# EAGLE design gatorBytes_button_board (EAGLE 9.1.0)
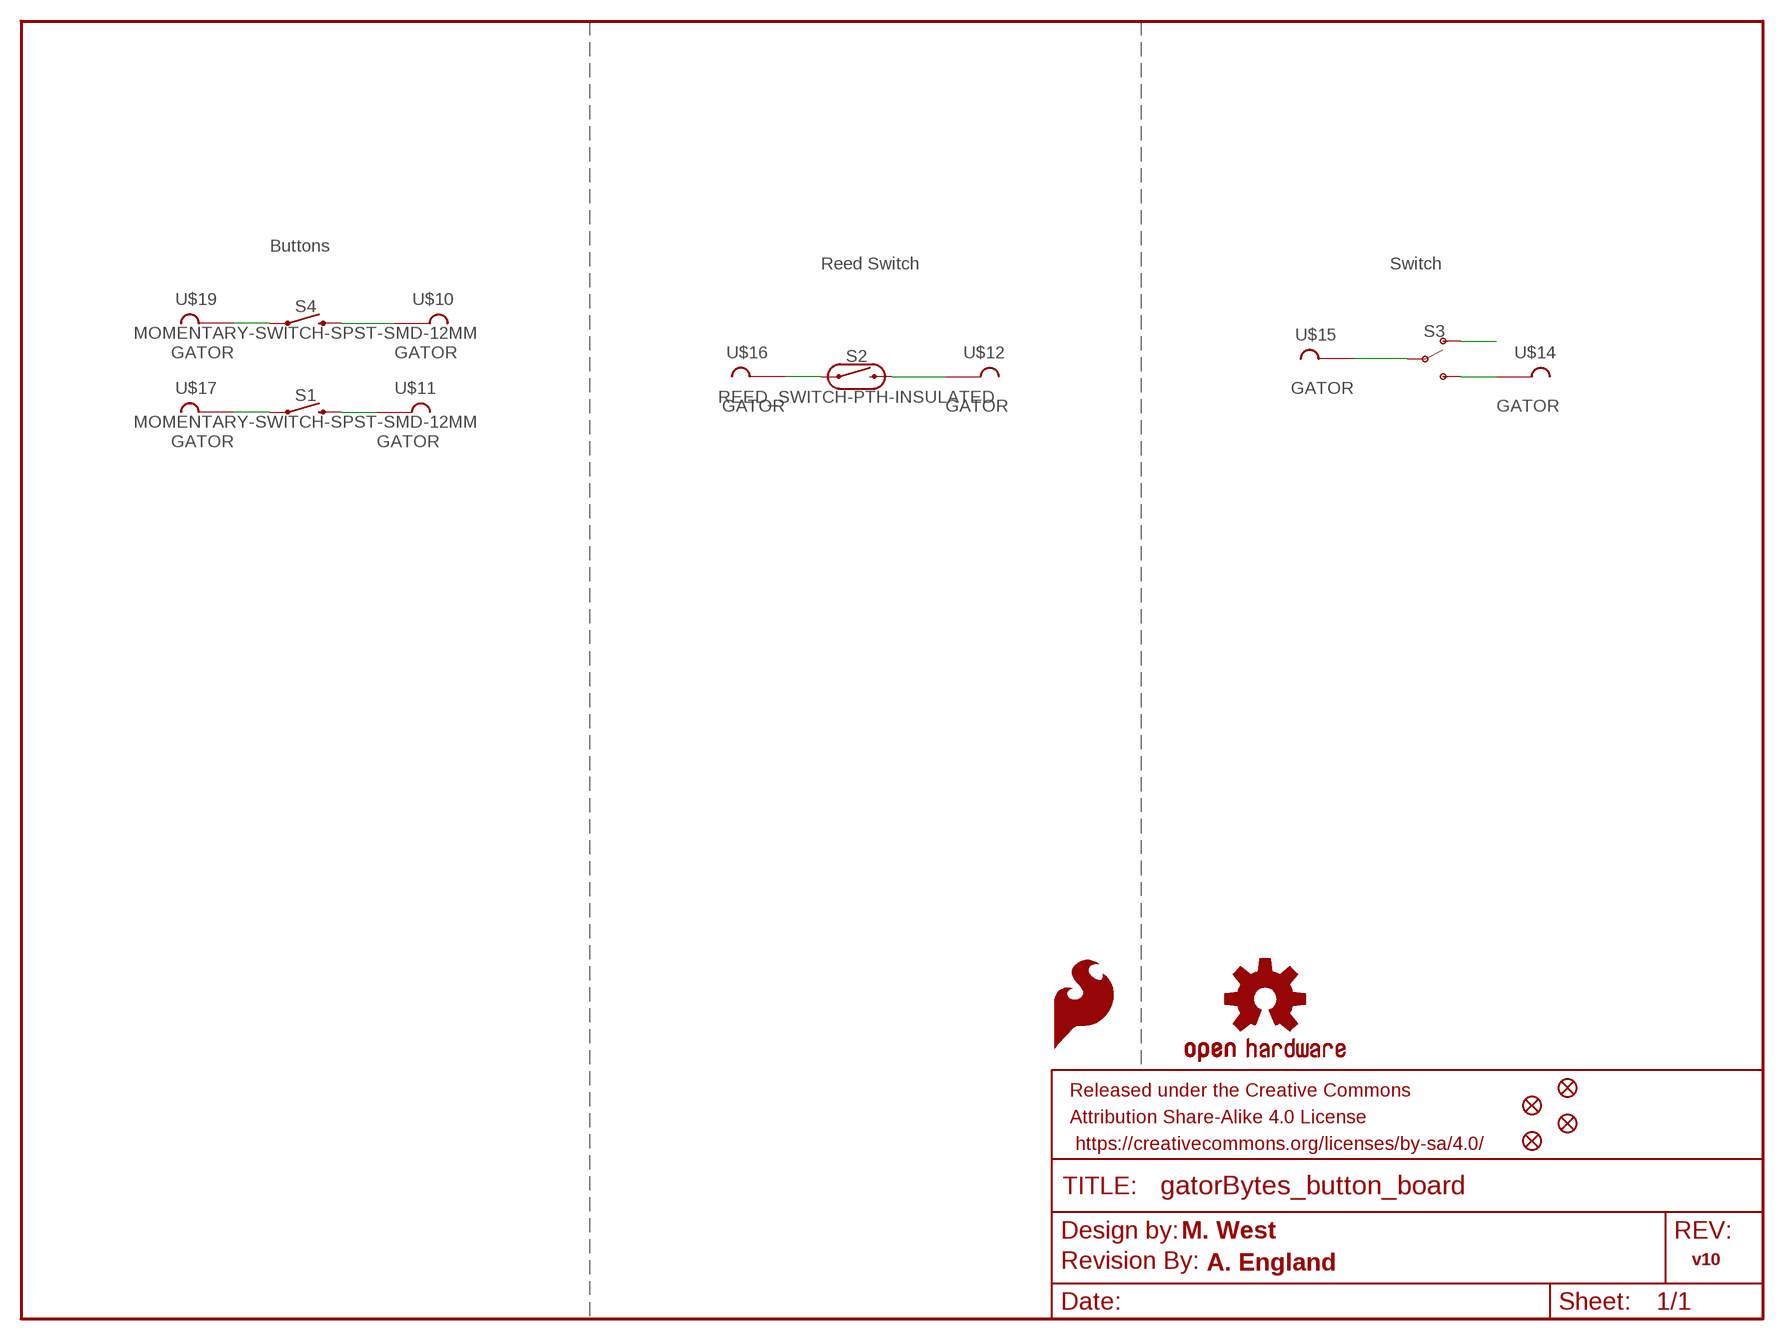
[diagram p0: schematic, sheet 1]

## Parts
FD1  FIDUCIALUFIDUCIAL  [FIDUCIAL-MICRO]
FD2  FIDUCIALUFIDUCIAL  [FIDUCIAL-MICRO]
FD3  FIDUCIALUFIDUCIAL  [FIDUCIAL-MICRO]
FD4  FIDUCIALUFIDUCIAL  [FIDUCIAL-MICRO]
FRAME1  FRAME-LETTER  [CREATIVE_COMMONS]
LOGO1  SFE_LOGO_FLAME.1_INCH  [SFE_LOGO_FLAME_.1]
LOGO2  OSHW-LOGOS  [OSHW-LOGO-S]
LOGO9  REVISION  [REVISION]
S1  MOMENTARY-SWITCH-SPST-SMD-12MM  [TACTILE_SWITCH_SMD_12MM]
S2  REED_SWITCH-PTH-INSULATED  [REED_SWITCH_PLASTIC]
S3  SWITCH-SPDT-SMD-AYZ0202  [SWITCH_DPDT_SMD_AYZ0202]
S4  MOMENTARY-SWITCH-SPST-SMD-12MM  [TACTILE_SWITCH_SMD_12MM]
U$10  GATOR  [GATOR]
U$11  GATOR  [GATOR]
U$12  GATOR  [GATOR]
U$14  GATOR  [GATOR]
U$15  GATOR  [GATOR]
U$16  GATOR  [GATOR]
U$17  GATOR  [GATOR]
U$19  GATOR  [GATOR]

## Nets
N$1: S4.1 U$19.P$1 U$19.P$2
N$2: S4.3 U$10.P$1 U$10.P$2
N$3: S1.1 U$17.P$1 U$17.P$2
N$4: S1.3 U$11.P$1 U$11.P$2
N$5: S2.P$1 U$16.P$1 U$16.P$2
N$6: S2.P$2 U$12.P$1 U$12.P$2
N$7: S3.2(P) U$15.P$1 U$15.P$2
N$8: S3.1(O)
N$9: S3.3(S) U$14.P$1 U$14.P$2

## Notes on the sheet
- Buttons
- Reed Switch | Switch
- M. West
- v10
- A. England

## Library data of the parts
FD1-FD4 = SparkFun-Aesthetics:FIDUCIAL: Fiducial Alignment Points Point-of-reference for pick-and-place machines and other optical instruments.
FRAME1 = SparkFun-Aesthetics:FRAME-LETTER: Schematic Frame - Letter Standard 8.5x11 US Letter frame
LOGO1 = SparkFun-Aesthetics:SFE_LOGO_FLAME: SparkFun Flame Logo This is the SparkFun flame logo. The logo on the schematic will always be the same size; the package variant is the height of the flame. Default layer for the logo on the board is tSilk.
LOGO2 = SparkFun-Aesthetics:OSHW-LOGO: Open-Source Hardware (OSHW) Logo This logo indicates the piece of hardware it is found on incorporates a OSHW license and/or adheres to the definition of open source hardware found here: http://freedomdefined.org/OSHW
LOGO9 = SparkFun-Aesthetics:REVISION: "Revision By" Text Preceding text for revisor documentation. Includes schematic text on "symbols" layer, and board text on tDoc.
S1 S4 = SparkFun-Switches:MOMENTARY-SWITCH-SPST: Momentary Switch (Pushbutton) - SPST Normally-open (NO) SPST momentary switches (buttons, pushbuttons). Variants PTH-12MM - 12mm square, through-hole Momentary Pushbutton Switch - 12mm Square <https://www.sparkfun.com/products/9190> (COM-09190) PTH-6.0MM, PTH-6.0MM-KIT - 6.0mm square, through-hole Mini Pushbutton Switch <https://www.sparkfun.com/products/97> (COM-00097) KIT package intended for soldering kit's - only one side of pads' copper is exposed. PTH-RIGHT-ANGLE-KIT - Right-angle, through-hole Right Angle Tactile Button <https://www.sparkfun.com/products/10791> - Used on SparkFun BigTime Watch Kit <https://www.sparkfun.com/products/11734> SMD-12MM - 12mm square, surface-mount Tactile Button - SMD (12mm) <https://www.sparkfun.com/products/12993> (COM-12993) Used on SparkFun PicoBoard <https://www.sparkfun.com/products/11888> SMD-4.5MM - 4.5mm Square Trackball Switch Used on SparkFun Blackberry Trackballer Breakout <https://www.sparkfun.com/products/13169> SMD-4.6MMX2.8MM - 4.60mm x 2.80mm, surface mount Used on SparkFun SAMD21 Mini Breakout <https://www.sparkfun.com/products/13664> SMD-5.2MM, SMD-5.2-REDUNDANT - 5.2mm square, surface-mount Mini Pushbutton Switch - SMD <https://www.sparkfun.com/products/8720> (COM-08720) Used on Arduino Pro Mini <https://www.sparkfun.com/products/11114> REDUNDANT package connects both switch circuits together SMD-6.0X3.5MM - 6.0 x 3.5mm, surface mount Momentary Reset Switch SMD <https://www.sparkfun.com/products/8229> (COM-08229) SMD-6.2MM-TALL - 6.2mm square, surface mount Tactile Button - SMD (6mm) <https://www.sparkfun.com/products/12992> Used on SparkFun Digital Sandbox <https://www.sparkfun.com/products/12651> SMD-RIGHT-ANGLE - Right-angle, surface mount Used on SparkFun Block for Intel® Edison - Arduino <https://www.sparkfun.com/products/13036>; PROD_ID: SWCH-11967; SF_SKU: COM-12993
S2 = SparkFun-Switches:REED_SWITCH: Reed Switch A reed switch is a magnetically-actuated switch. When the device is exposed to a magnetic field, the two ferrous materials inside the switch pull together and the switch closes. Variant Overview PTH-GLASS Reed Switch <https://www.sparkfun.com/products/8642> (COM-08642) - PTH reed switch w/ glass body (6.0 x 0.9 mm) PTH-INSULATED Reed Switch - Insulated <https://www.sparkfun.com/products/10601> (COM-10601) - PTH reed switch w/ insulated body (15.1 x 4.2 mm); PROD_ID: SWCH-10467; SF_SKU: COM-10601
S3 = SparkFun-Switches:SWITCH-SPDT: Single Pole, Double Throw (SPDT) Switch Single-pole, double-throw (SPDT) switch. Variant Overview SMD-AYZ0202 Surface Mount DPDT Switch <https://www.sparkfun.com/products/597> (COM-00597) Used on e.g. LilyPad Arduino USB - ATmega32U4 Board <https://www.sparkfun.com/products/12049> PTH-11.6X4.0MM SPDT Mini Power Switch <https://www.sparkfun.com/products/102> (COM-00102) Used on e.g. SparkFun Simon Says - Through-Hole Soldering Kit <https://www.sparkfun.com/products/10547> (KIT-10547) PTH-11.6X4.0MM-KIT KIT version of SPDT Mini Power Switch - Simplifies soldering by removing tStop of switch pins - only one side can be soldered. PTH-11.6X4.0MM-LOCK LOCK version of SPDT Mini Power Switch - Offset pins hold switch in place for easier soldering. SMD-RIGHT-ANGLE Surface Mount Right Angle Switch <https://www.sparkfun.com/products/10860> (COM-10860) Used on e.g. SparkFun ESP8266 Thing <https://www.sparkfun.com/products/13231>; PROD_ID: SWCH-08179; SF_ID: COM-00597
U$10-U$12 U$14-U$17 U$19 = SparkFun-Connectors:GATOR

## Board
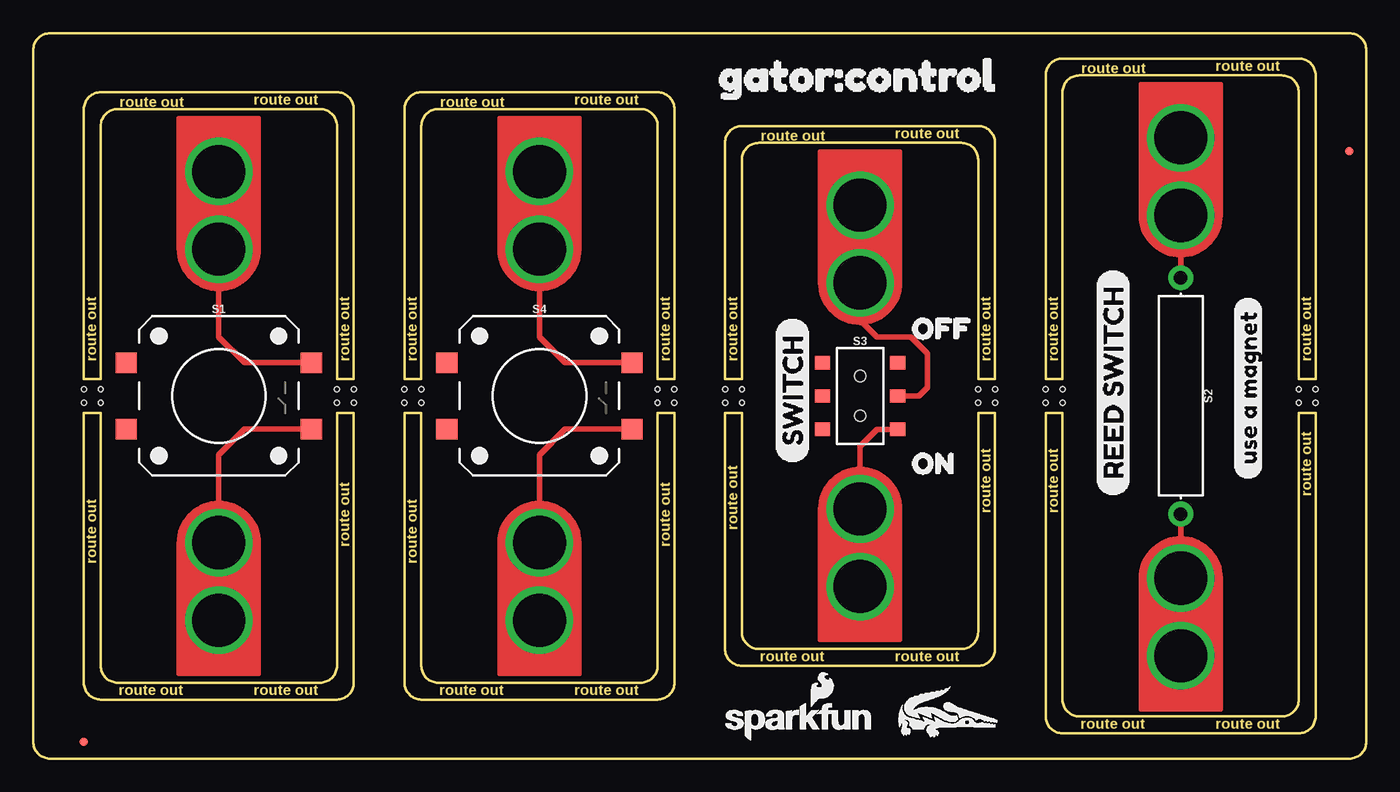
[diagram p1: board, top side]
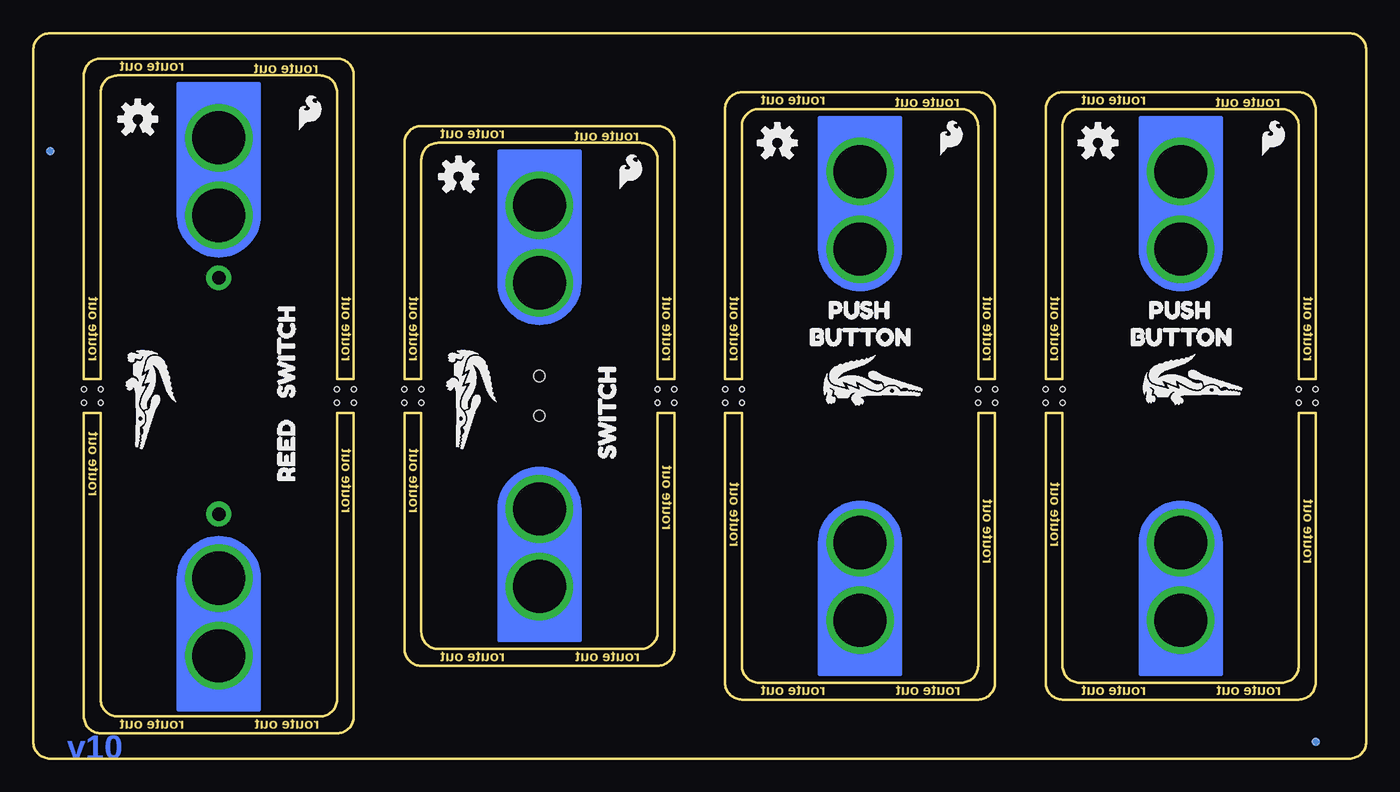
[diagram p2: board, bottom side, seen from below]

Size 100.33 x 54.61 mm. Coordinates in mm from the lower left corner, seen from the top.
Outline: 1.27,0 arc-90 0,1.27 0,53.34 arc-90 1.27,54.61 99.06,54.61 arc-90 100.33,53.34 100.33,1.27 arc-90 99.06,0 1.27,0
Outline: 21.59,48.9 arc-90 22.86,47.62 22.86,28.57 24.13,28.57 24.13,48.9 arc90 22.86,50.16 15.24,50.16 5.08,50.16 arc90 3.81,48.9 3.81,28.57 5.08,28.57 5.08,47.62 arc-90 6.35,48.9 15.24,48.9 21.59,48.9
Outline: 22.86,6.99 arc-90 21.59,5.71 12.7,5.71 6.35,5.71 arc-90 5.08,6.99 5.08,26.04 3.81,26.04 3.81,5.71 arc90 5.08,4.45 12.7,4.45 22.86,4.45 arc90 24.13,5.71 24.13,26.04 22.86,26.04 22.86,6.99
Outline: 45.72,48.9 arc-90 46.99,47.62 46.99,28.57 48.26,28.57 48.26,48.9 arc90 46.99,50.16 39.37,50.16 29.21,50.16 arc90 27.94,48.9 27.94,28.57 29.21,28.57 29.21,47.62 arc-90 30.48,48.9 39.37,48.9 45.72,48.9
Outline: 46.99,6.99 arc-90 45.72,5.71 39.37,5.71 30.48,5.71 arc-90 29.21,6.99 29.21,26.04 27.94,26.04 27.94,5.71 arc90 29.21,4.45 39.37,4.45 46.99,4.45 arc90 48.26,5.71 48.26,26.04 46.99,26.04 46.99,6.99
Outline: 69.85,46.35 arc-90 71.12,45.09 71.12,28.57 72.39,28.57 72.39,46.35 arc90 71.12,47.62 63.5,47.62 53.34,47.62 arc90 52.07,46.35 52.07,28.57 53.34,28.57 53.34,45.09 arc-90 54.61,46.35 63.5,46.35 69.85,46.35
Outline: 71.12,9.53 arc-90 69.85,8.26 63.5,8.26 54.61,8.26 arc-90 53.34,9.53 53.34,26.04 52.07,26.04 52.07,8.26 arc90 53.34,6.99 63.5,6.99 71.12,6.99 arc90 72.39,8.26 72.39,26.04 71.12,26.04 71.12,9.53
Outline: 93.98,51.44 arc-90 95.25,50.16 95.25,28.57 96.52,28.57 96.52,51.44 arc90 95.25,52.7 87.63,52.7 77.47,52.7 arc90 76.2,51.44 76.2,28.57 77.47,28.57 77.47,50.16 arc-90 78.74,51.44 87.63,51.44 93.98,51.44
Outline: 95.25,4.45 arc-90 93.98,3.17 87.63,3.17 78.74,3.17 arc-90 77.47,4.45 77.47,26.04 76.2,26.04 76.2,3.17 arc90 77.47,1.91 87.63,1.91 95.25,1.91 arc90 96.52,3.17 96.52,26.04 95.25,26.04 95.25,4.45
Copper layers (1*16): Top 0.035mm / dielectric 1.5mm / Bottom 0.035mm
Design rules "SparkFun-2-layer-TIGHT": minimum track width 7mil, minimum drill 15mil, track to track 7mil, track to pad 7mil, pad to pad 7mil, via to via 7mil, smd to smd 7mil, copper to edge 7mil, drill to drill 7mil, minimum pad ring 7mil, minimum via ring 7mil, stop-mask expansion 4mil, vias tented up to drill 25mil, thermal gap 10mil
Holes 0.38 mm at 95.25,27.81 95.25,26.8 77.47,26.8 77.47,27.81 53.34,26.8 53.34,27.81 46.99,26.8 46.99,27.81 29.21,26.8 29.21,27.81 22.86,26.8 22.86,27.81 5.08,26.8 5.08,27.81 27.94,27.81 27.94,26.8 24.13,27.81 24.13,26.8 3.81,27.81 3.81,26.8 48.26,27.81 48.26,26.8 52.07,27.81 52.07,26.8 76.2,27.81 72.39,27.81 71.12,27.81 76.2,26.8 72.39,26.8 71.12,26.8 96.52,27.81 96.52,26.8

### Footprints (pad centres in the part's own frame; a part is rotated, then mirrored left to right if it is on the bottom)
FIDUCIAL-MICRO = smd 0.635 x 0.635: 1 0,0
TACTILE_SWITCH_SMD_12MM = smd 1.6 x 1.55: 1 6.975,-2.5; 2 -6.975,-2.5; 3 6.975,2.5; 4 -6.975,2.5
REED_SWITCH_PLASTIC = drill 1.016 pad 1.88: P$1 -8.89,0; P$2 8.89,0
SWITCH_DPDT_SMD_AYZ0202 = smd 1 x 1.15: 1 -2.5,2.825; 2 0,2.825; 3 2.5,2.825; 4 -2.5,-2.825; 5 0,-2.825; 6 2.5,-2.825 | hole 0.85: 1.5,0; -1.5,0
GATOR = drill 4 pad 5.08: P$1 0,-6.096; P$2 0,-0.254

### Placement (x,y rotation side)
FD1  99.06,45.72 0 top
FD2  99.06,45.72 0 bottom
FD3  3.81,1.27 0 bottom
FD4  3.81,1.27 0 top
FRAME1  22.23,-9.53 0 top  (outside the outline)
LOGO1  56.52,42.55 0 bottom
LOGO2  68.33,43.81 0 bottom
LOGO3  OSHW-LOGOS  [OSHW-LOGO-S]  44.32,46.35 0 bottom
LOGO4  SFE_LOGO_FLAME.1_INCH  [SFE_LOGO_FLAME_.1]  32.38,45.09 0 bottom
LOGO5  OSHW-LOGOS  [OSHW-LOGO-S]  20.19,46.35 0 bottom
LOGO6  SFE_LOGO_FLAME.1_INCH  [SFE_LOGO_FLAME_.1]  8.13,45.09 0 bottom
LOGO7  SFE_LOGO_FLAME.1_INCH  [SFE_LOGO_FLAME_.1]  80.64,46.99 0 bottom
LOGO8  OSHW-LOGOS  [OSHW-LOGO-S]  92.46,48.13 0 bottom
LOGO9  33.78,-11.56 0 top  (outside the outline)
S1  13.97,27.3 0 top
S2  86.36,27.3 270 top
S3  62.23,27.3 270 top
S4  38.1,27.3 0 top
U$1  [GATOR#PNG]  91.38,27.37 270 bottom
U$2  [BUTTON3]  18.92,31.75 0 bottom
U$3  [PUSH4]  17.53,33.78 0 bottom
U$4  [PUSH4]  41.66,33.78 0 bottom
U$5  [BUTTON3]  43.05,31.75 0 bottom
U$6  [OFF9]  64.77,32.38 0 top
U$7  [REED_SWITCH0]  81.28,19.68 90 top
U$8  [SWITCH2]  57.15,22.23 90 top
U$9  [USE_A_MAGNET10]  91.44,20.95 90 top
U$10  38.1,38.1 180 top
U$11  13.97,38.1 180 top
U$12  86.36,13.84 0 top
U$13  [ON8]  64.77,22.23 0 top
U$14  62.23,19.05 0 top
U$15  62.23,35.56 180 top
U$16  86.36,40.64 180 top
U$17  13.97,16.51 0 top
U$18  [SWITCH5]  57.15,21.46 90 bottom
U$19  38.1,16.51 0 top
U$20  [REED6]  81.28,19.68 90 bottom
U$21  [SWITCH5]  81.28,26.04 90 bottom
U$22  [GATOR#PNG]  68.52,3.62 0 top
U$23  [GATOR#CONTROL0]  49.53,51.44 0 top
U$24  [SFE_LOGO_NAME_FLAME_.1]  51.69,1.27 0 top
U$28  [GATOR#PNG]  37.47,28.57 0 bottom
U$29  [GATOR#PNG]  67.25,27.37 270 bottom
U$33  [ORDERING_INSTRUCTIONS]  -3.81,-12.06 0 top  (outside the outline)
U$70  [GATOR#PNG]  13.4,28.64 0 bottom

### Tracks (layer width: path | path; a pad name or v marks a point on that pad's centre or on a via)
N$1
  Top 0.203: U$19.P$2 U$19.P$1
  Top 0.406: U$19.P$2 38.1,22.86 40.05,24.8 S4.1
N$2
  Top 0.203: U$10.P$1 38.1,38.1 U$10.P$2
  Top 0.406: U$10.P$1 38.1,42.77 | S4.3 40.05,29.8 38.1,31.75 38.1,38.1
N$3
  Top 0.203: U$17.P$2 U$17.P$1
  Top 0.406: S1.1 15.91,24.8 13.97,22.86 U$17.P$2
N$4
  Top 0.203: U$11.P$1 13.97,38.1 U$11.P$2
  Top 0.406: S1.3 15.91,29.8 13.97,31.75 13.97,38.1
N$5
  Top 0.203: U$16.P$2 86.36,40.64
  Top 0.406: 86.36,39.37 86.36,40.64 | 86.36,40.64 U$16.P$1 | S2.P$1 86.36,40.64
N$6
  Top 0.406: S2.P$2 86.36,15.24 | 86.36,15.24 U$12.P$1 | U$12.P$2 86.36,15.24
N$7
  Top 0.203: 62.23,33.02 U$15.P$1 62.23,38.99 61.98,38.73
  Top 0.406: 60.96,38.73 61.98,38.73 62.1,38.73 62.11,38.73 | S3.2 66.67,27.3 67.31,27.94 67.31,30.48 66.04,31.75 63.5,31.75 62.23,33.02 U$15.P$2
N$9
  Top 0.406: S3.3 65.02,24.77 63.5,24.77 62.23,23.5 62.23,17.78 U$14.P$2 U$14.P$1

### Text on the board
Bottom: v10
Dimension: route out | route out | route out | route out | route out | route out | route out | route out | route out | route out | route out | route out | route out | route out | route out | route out | route out | route out | route out | route out | route out | route out | route out | route out | route out | route out | route out | route out | route out | route out | route out | route out
tDocu: M. West | A. England | Solder Mask: Black Gloss